# EAGLE design DBFTDI (EAGLE 8.4.3)
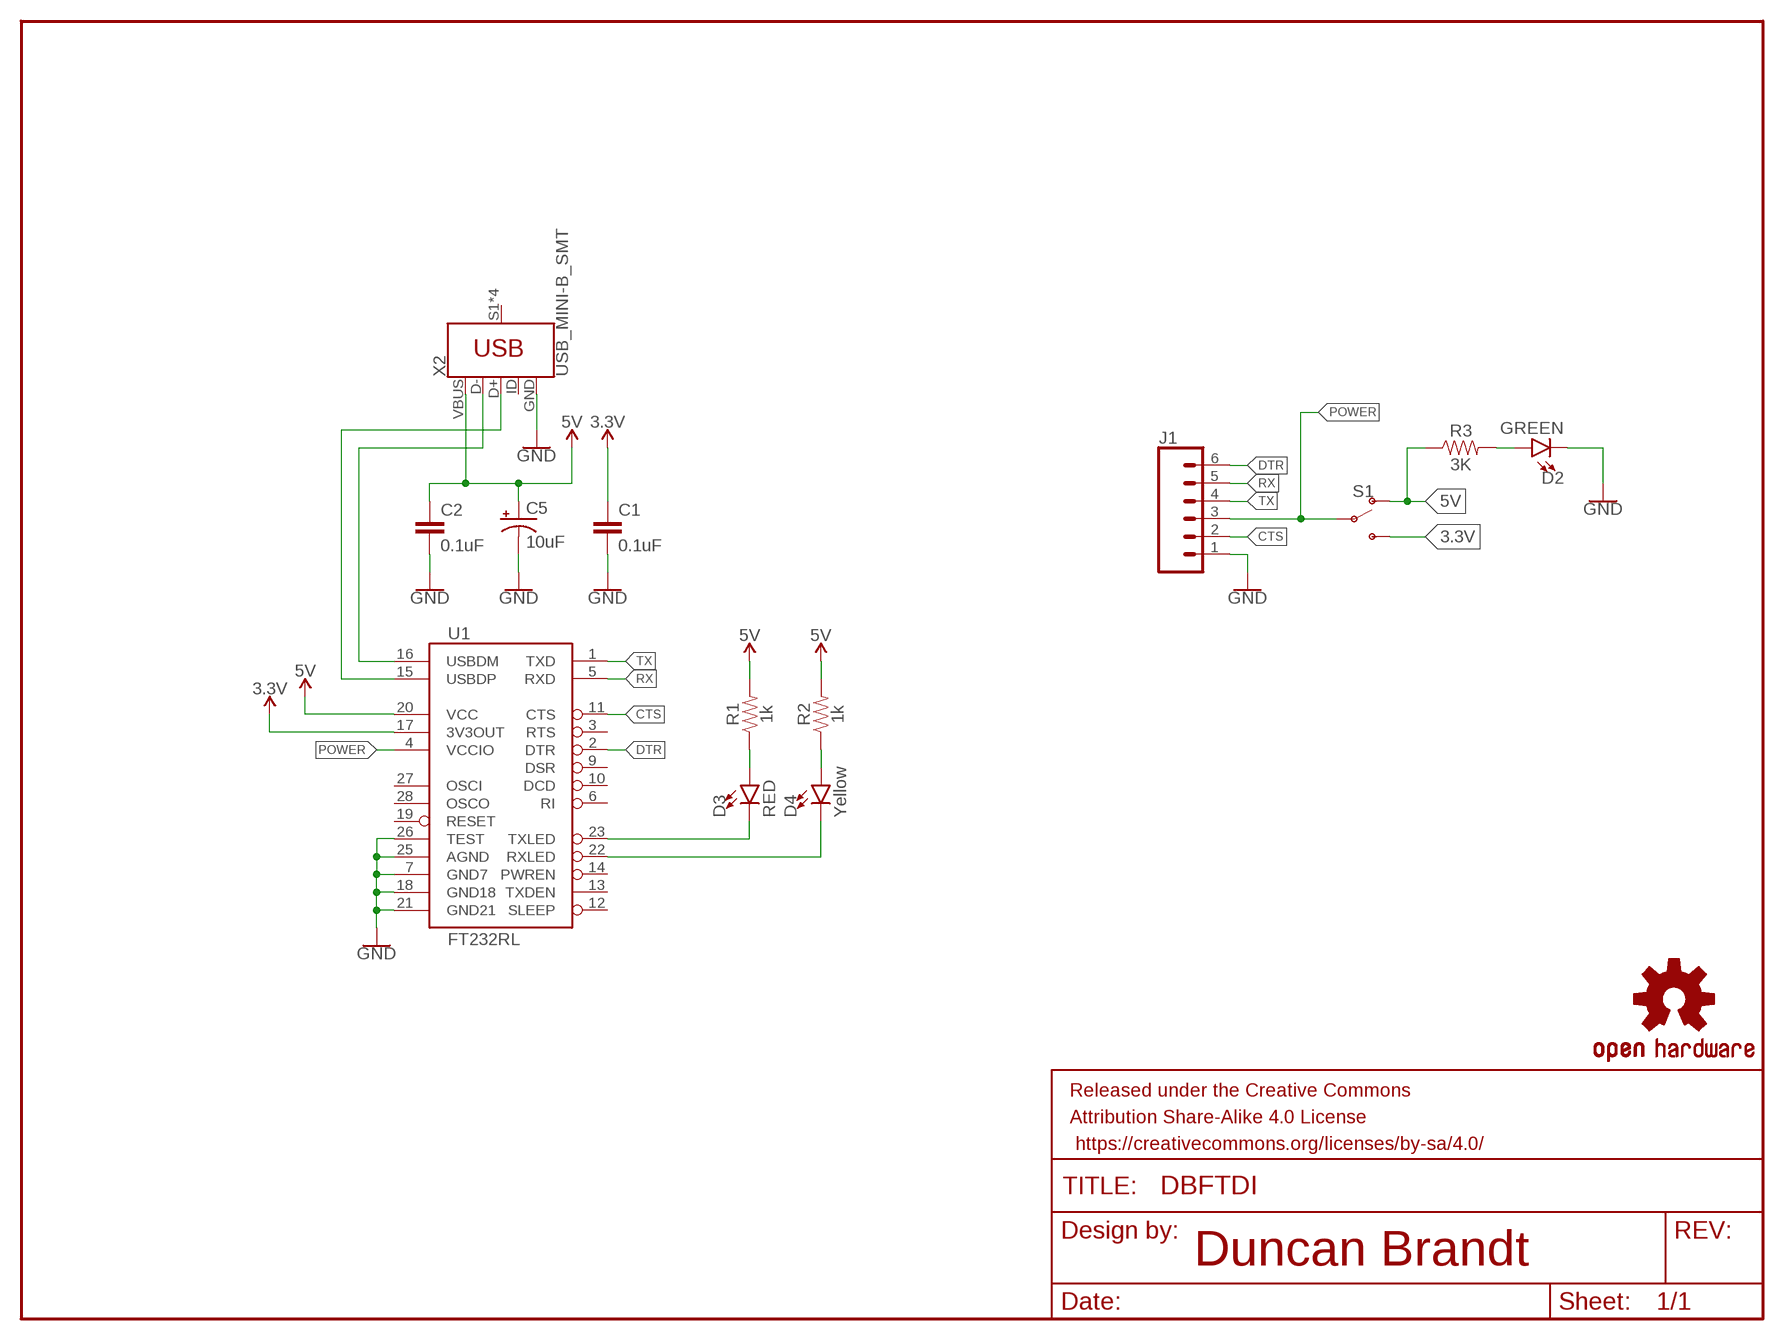
[diagram p0: schematic, sheet 1]

## Parts
C1  0.1uF  0.1UF-0603-25V-5%  [0603]
C2  0.1uF  0.1UF-0603-25V-5%  [0603]
C5  10uF  10UF-POLAR-EIA3216-16V-10%(TANT)  [EIA3216]
D2  GREEN  LED-GREEN1206  [LED-1206]
D3  RED  LED-RED1206  [LED-1206]
D4  Yellow  LED-YELLOW1206  [LED-1206]
FRAME1  FRAME-LETTER  [CREATIVE_COMMONS]
J1  CONN_06SILK_FEMALE_PTH  [1X06]
LOGO1  OSHW-LOGOL  [OSHW-LOGO-L]
R1  1k  1KOHM-0603-1/10W-1%  [0603]
R2  1k  1KOHM-0603-1/10W-1%  [0603]
R3  3K  3KOHM-0603-1/10W-1%  [0603]
S1  SWITCH-SPDT-SMD-AYZ0202  [SWITCH_DPDT_SMD_AYZ0202]
U1  FT232RL  FT232RLSSOP  [SSOP28DB]
X2  USB_MINI-B_SMT  [USB-MINIB]

## Nets
3.3V [power]: C1.1 S1.3(S) U1.17(3V3OUT)
5V: C2.1 C5.+ R1.2 R2.2 R3.1 S1.1(O) U1.20(VCC) X2.VBUS
CTS: J1.2 U1.11(CTS)
DTR: J1.6 U1.2(DTR)
GND [power]: C1.2 C2.2 C5.- D2.C J1.1 U1.7(GND7) U1.18(GND18) U1.21(GND21) U1.25(AGND) U1.26(TEST) X2.GND
N$1: D3.A R1.1
N$2: D4.A R2.1
N$3: D2.A R3.2
N$5: U1.15(USBDP) X2.D+
N$6: U1.16(USBDM) X2.D-
POWER: J1.3 S1.2(P) U1.4(VCCIO)
RX: J1.5 U1.5(RXD)
RXLED: D4.C U1.22(RXLED)
TX: J1.4 U1.1(TXD)
TXLED: D3.C U1.23(TXLED)
Unconnected: U1.3(RTS) U1.6(RI) U1.9(DSR) U1.10(DCD) U1.12(SLEEP) U1.13(TXDEN) U1.14(PWREN) U1.19(RESET) U1.27(OSCI) U1.28(OSCO) X2.ID X2.S1(SHIELD) X2.S2(SHIELD) X2.S3(SHIELD) X2.S4(SHIELD)

## Notes on the sheet
- Duncan Brandt

## Library data of the parts
C1 C2 = DB-CAP:0.1UF: 0.1µF ceramic capacitors Package: 0603 A capacitor is a passive two-terminal electrical component used to store electrical energy temporarily in an electric field. DB BOARDS: DB Drawing Board <www.dbboards.com>; PROD_ID: CAP-08604
C5 = DB-CAP:10UF-POLAR: 10.0µF polarized capacitors A capacitor is a passive two-terminal electrical component used to store electrical energy temporarily in an electric field.
D2 = DB-LED:LED-GREEN: Green SMD LED Package: 1206 DB BOARDS: DB Drawing Board <www.dbboards.com>
D3 = DB-LED:LED-RED: Red SMD LED Package: 1206 DB BOARDS: DB Drawing Board <www.dbboards.com>
D4 = DB-LED:LED-YELLOW: Yellow SMD LED Package: 1206 DB BOARDS: DB Drawing Board <www.dbboards.com>
FRAME1 = DB-SYMBOLS:FRAME-LETTER: Schematic Frame - Letter Standard 8.5x11 US Letter frame
J1 = DB-CONN:CONN_06: 6 Pin Header Multi connection point. Often used as Generic Header-pin footprint for 0.1 inch spaced/style header connections DB BOARDS: DB Drawing Board <www.dbboards.com>; PROD_ID: CONN-08437
LOGO1 = DB-SYMBOLS:OSHW-LOGO: Open-Source Hardware (OSHW) Logo This logo indicates the piece of hardware it is found on incorporates a OSHW license and/or adheres to the definition of open source hardware found here: http://freedomdefined.org/OSHW
R1 R2 = DB-RES:1KOHM: 1kΩ Resistor Package: 0603 A resistor is a passive two-terminal electrical component that implements electrical resistance as a circuit element. Resistors act to reduce current flow, and, at the same time, act to lower voltage levels within circuits. - Wikipedia DB BOARDS: DB Drawing Board <www.dbboards.com>; PROD_ID: RES-07856
R3 = DB-RES:3KOHM: 3kΩ Resistor Package: 0603 A resistor is a passive two-terminal electrical component that implements electrical resistance as a circuit element. Resistors act to reduce current flow, and, at the same time, act to lower voltage levels within circuits. - Wikipedia DB BOARDS: DB Drawing Board <www.dbboards.com>; PROD_ID: RES-09334
S1 = DB-BTNSWTCH:SWITCH-SPDT: Single Pole, Double Throw (SPDT) Switch Single-pole, double-throw (SPDT) switch.; PROD_ID: SWCH-08179; SF_ID: COM-00597
U1 = DB-COMM:FT232RL: FT232RL USB UART FT232RL 4th Generation USB UART (USB <-> Serial) Controller.; PROD_ID: IC-00870
X2 = DB-CONN:USB_MINI-B: USB type Mini-B Connector Package: USB-MINIB DB BOARDS: DB Drawing Board <www.dbboards.com>

## Net classes
0 default: width 0.203 mm
1 power: width 0.254 mm

## Board
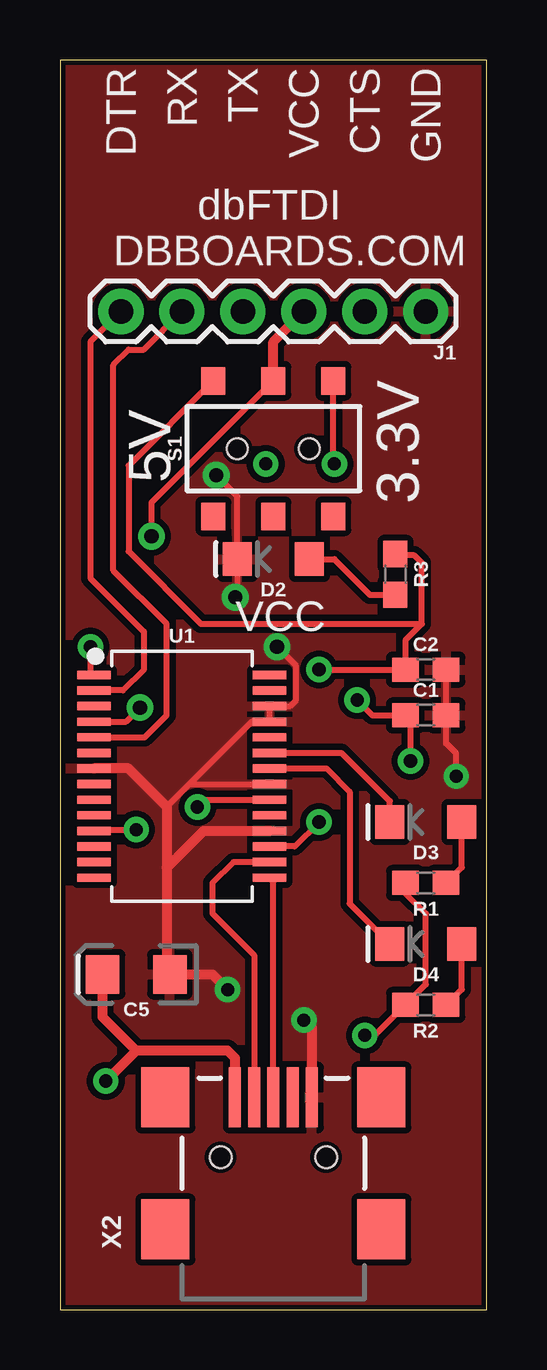
[diagram p1: board, top side]
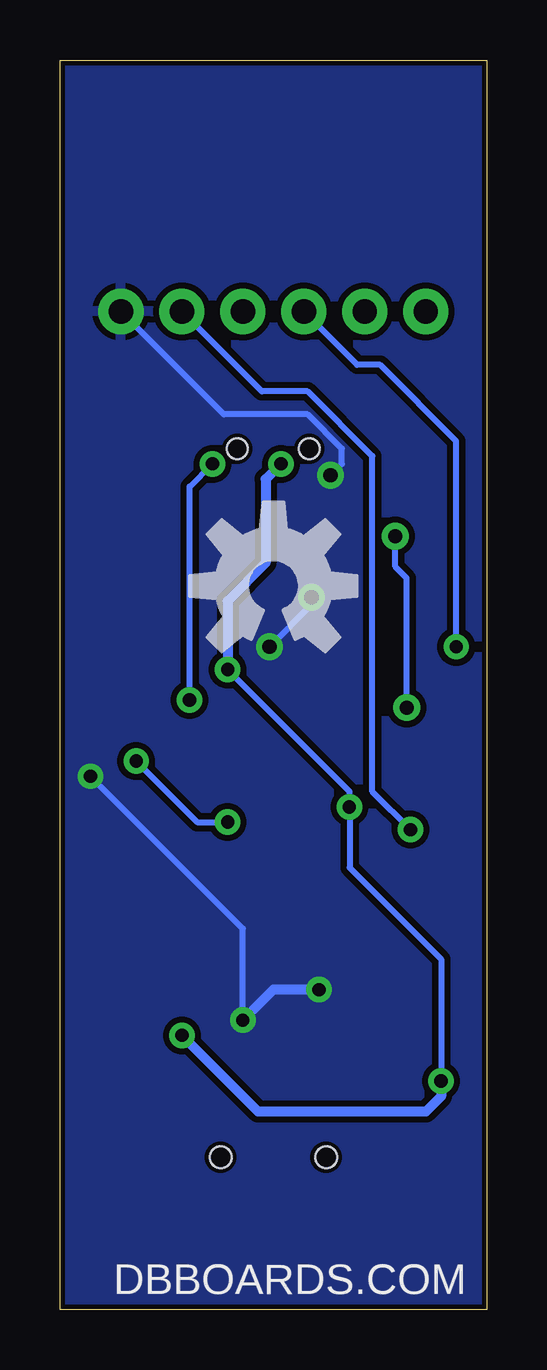
[diagram p2: board, bottom side, seen from below]

Size 17.78 x 52.07 mm. Coordinates in mm from the lower left corner, seen from the top.
Outline: 0,0 17.78,0 17.78,52.07 0,52.07 0,0
Copper layers (1*16): Top 0.035mm / dielectric 1.5mm / Bottom 0.035mm
Design rules "SparkFun-2-layer-STANDARD": minimum track width 10mil, minimum drill 20mil, track to track 10mil, track to pad 8mil, pad to pad 8mil, via to via 10mil, smd to smd 8mil, copper to edge 8mil, drill to drill 8mil, minimum pad ring 10mil, minimum via ring 10mil, stop-mask expansion 4mil, vias tented up to drill 25mil, thermal gap 10mil

### Footprints (pad centres in the part's own frame; a part is rotated, then mirrored left to right if it is on the bottom)
0603 = smd 1.1 x 1: 1 -0.85,0; 2 0.85,0
EIA3216 = smd 1.4 x 1.6: + 1.4,0; - -1.4,0
LED-1206 = smd 1.2 x 1.4: A -1.5,0; C 1.5,0
1X06 = drill 1.016 pad 1.88: 1 0,0; 2 2.54,0; 3 5.08,0; 4 7.62,0; 5 10.16,0; 6 12.7,0
SWITCH_DPDT_SMD_AYZ0202 = smd 1 x 1.15: 1 -2.5,2.825; 2 0,2.825; 3 2.5,2.825; 4 -2.5,-2.825; 5 0,-2.825; 6 2.5,-2.825 | hole 0.85: 1.5,0; -1.5,0
SSOP28DB = smd 0.348 x 1.397: 1 -4.225,-3.656; 2 -3.575,-3.656; 3 -2.925,-3.656; 4 -2.275,-3.656; 5 -1.625,-3.656; 6 -0.975,-3.656; 7 -0.325,-3.656; 8 0.325,-3.656; 9 0.975,-3.656; 10 1.625,-3.656; 11 2.275,-3.656; 12 2.925,-3.656; 13 3.575,-3.656; 14 4.225,-3.656; 15 4.225,3.656; 16 3.575,3.656; 17 2.925,3.656; 18 2.275,3.656; 19 1.625,3.656; 20 0.975,3.656; 21 0.325,3.656; 22 -0.325,3.656; 23 -0.975,3.656; 24 -1.625,3.656; 25 -2.275,3.656; 26 -2.925,3.656; 27 -3.575,3.656; 28 -4.225,3.656
USB-MINIB = smd 2.5 x 0.5: D+ 2.5,0; D- 2.5,0.8; GND 2.5,-1.6; ID 2.5,-0.8; VBUS 2.5,1.6 | smd 2.5 x 2: S1 -3,4.5; S2 2.5,4.5; S3 -3,-4.5; S4 2.5,-4.5 | hole 0.9: 0,2.2; 0,-2.2

### Placement (x,y rotation side)
C1  15.24,24.77 0 top
C2  15.24,26.67 0 top
C5  3.17,13.97 180 top
D2  8.89,31.27 180 top
D3  15.24,20.32 180 top
D4  15.24,15.24 180 top
FRAME1  -104.73,0 0 top  (outside the outline)
J1  15.24,41.59 180 top
LOGO1  8.89,30.16 0 bottom
R1  15.24,17.78 180 top
R2  15.24,12.7 180 top
R3  13.97,30.64 270 top
S1  8.89,35.88 0 top
U1  5.08,22.23 270 top
X2  8.89,6.35 90 top

### Tracks (layer width: path | path; a pad name or v marks a point on that pad's centre or on a via)
3.3V  (via drill 0.55)
  Top 0.254: v10.79,20.32 9.78,19.3 U1.17 | v12.38,25.4 13.02,24.77 C1.1 14.61,24.55 v14.61,22.86 | v11.43,35.24 11.39,35.28 S1.3
  Bottom 0.254: v14.61,22.86 12.06,20.32 v10.79,20.32 | v12.38,25.4 12.38,34.29 v11.43,35.24
5V  (via drill 0.55)
  Top 0.254: R1.2 14.39,17.36 15.24,16.51 15.24,13.55 R2.2 13.12,11.43 v12.7,11.43 | U1.20 6.01,21.25 v5.71,20.95 | v10.79,26.67 C2.1 14.39,27.88 15.08,28.57 | S1.1 2.86,35.17 2.86,31.59 5.87,28.57 15.08,28.57 | 15.08,28.57 15.08,31.11 14.76,31.43 14.03,31.43 R3.1
  Top 0.406: X2.VBUS 7.29,10.49 6.99,10.79 3.17,10.79 | 3.17,10.79 1.77,12.2 C5.+ | 3.17,10.79 v1.91,9.53 | v5.71,20.95 v5.72,20.95
  Bottom 0.254: v1.91,9.53 1.91,14.61 5.71,18.41 v5.71,20.95 5.71,21.59 v10.79,26.67
  Bottom 0.406: v1.91,9.53 1.91,8.89 2.54,8.26 9.53,8.26 v12.7,11.43 | v8.57,35.24 9.21,34.61 9.21,31.11 10.79,29.53 v10.79,26.67 | v5.72,20.95 v5.71,20.95
CTS  (via drill 0.55)
  Top 0.254: U1.11 1.48,20 v3.17,20
  Bottom 0.254: v3.17,20 4.76,21.59 4.76,35.56 7.46,38.26 9.37,38.26 J1.2
DTR
  Top 0.254: J1.6 1.27,40.32 1.27,30.48 3.49,28.26 3.49,26.67 2.62,25.8 U1.2
GND  (via drill 0.55, 0.6)
  Top 0.254: 5.39,21.9 U1.21 | 5.39,21.9 4.45,20.95 | 5.39,21.9 7.99,24.5 U1.25 U1.26 9.59,25.15 9.84,25.4 9.84,26.83 v9.05,27.62 | v16.51,22.23 16.51,23.18 16.09,23.6 C1.2 C2.2 | v6.51,34.77 7.39,33.88 D2.C 7.39,29.77 v7.3,29.69
  Top 0.406: v6.99,13.34 6.35,13.97 C5.- 4.45,14.1 4.45,18.41 | v10.16,12.06 10.49,11.73 X2.GND | 4.45,18.41 5.98,19.95 U1.18 | 4.45,18.41 4.45,20.95 2.85,22.55 U1.7
  Bottom 0.254: v10.16,12.06 10.16,15.88 v16.51,22.23 | v9.05,27.62 7.3,29.37 v7.3,29.69 | v6.51,34.77 6.03,35.24 6.03,35.88 7.46,37.31 10.95,37.31 J1.1
  Bottom 0.406: v6.99,13.34 8.89,13.34 v10.16,12.06
  pour Top: 0,0 17.78,0 17.78,52.07 0,52.07
  pour Bottom: 0,0 0,52.07 17.78,52.07 17.78,0
N$1
  Top 0.254: R1.1 16.74,18.43 D3.A
N$2
  Top 0.254: R2.1 16.74,13.35 D4.A
N$3
  Top 0.254: D2.A 11.43,31.27 12.91,29.79 R3.2
N$5
  Top 0.254: 8.84,17.89 8.89,17.85 | 8.84,17.89 U1.15 | X2.D+ 8.89,17.85 | 8.89,17.85 8.84,17.89
N$6
  Top 0.254: U1.16 7.22,18.65 6.35,17.78 6.35,16.51 8.09,14.77 X2.D-
POWER  (via drill 0.6)
  Top 0.254: U1.4 2.75,24.5 v3.33,25.08 | S1.2 3.81,33.62 v3.81,32.23
  Top 0.406: S1.2 8.89,40.32 J1.3
  Bottom 0.254: v3.33,25.08 3.33,30.48 3.81,30.96 v3.81,32.23
RX
  Top 0.254: U1.5 3.53,23.85 4.45,24.77 4.45,28.57 2.22,30.8 2.22,39.37 2.86,40.01 3.49,40.01 J1.5
RXLED
  Top 0.254: U1.22 9.53,22.55 9.84,22.55 11.11,22.55 12.06,21.59 12.06,16.91 D4.C
TX  (via drill 0.55)
  Top 0.254: v1.27,27.62 1.27,26.6 U1.1
  Bottom 0.254: v1.27,27.62 1.27,36.2 4.45,39.37 5.4,39.37 J1.4
TXLED
  Top 0.254: D3.C 13.74,20.95 13.74,21.18 11.72,23.2 U1.23

### Text on the board
tPlace: DTR | RX | TX | VCC | CTS | GND | dbFTDI | DBBOARDS.COM | 3.3V | 5V | VCC
bPlace: DBBOARDS.COM